# Altium project STM32WL_Sens_ADC_Bat.PrjPcb
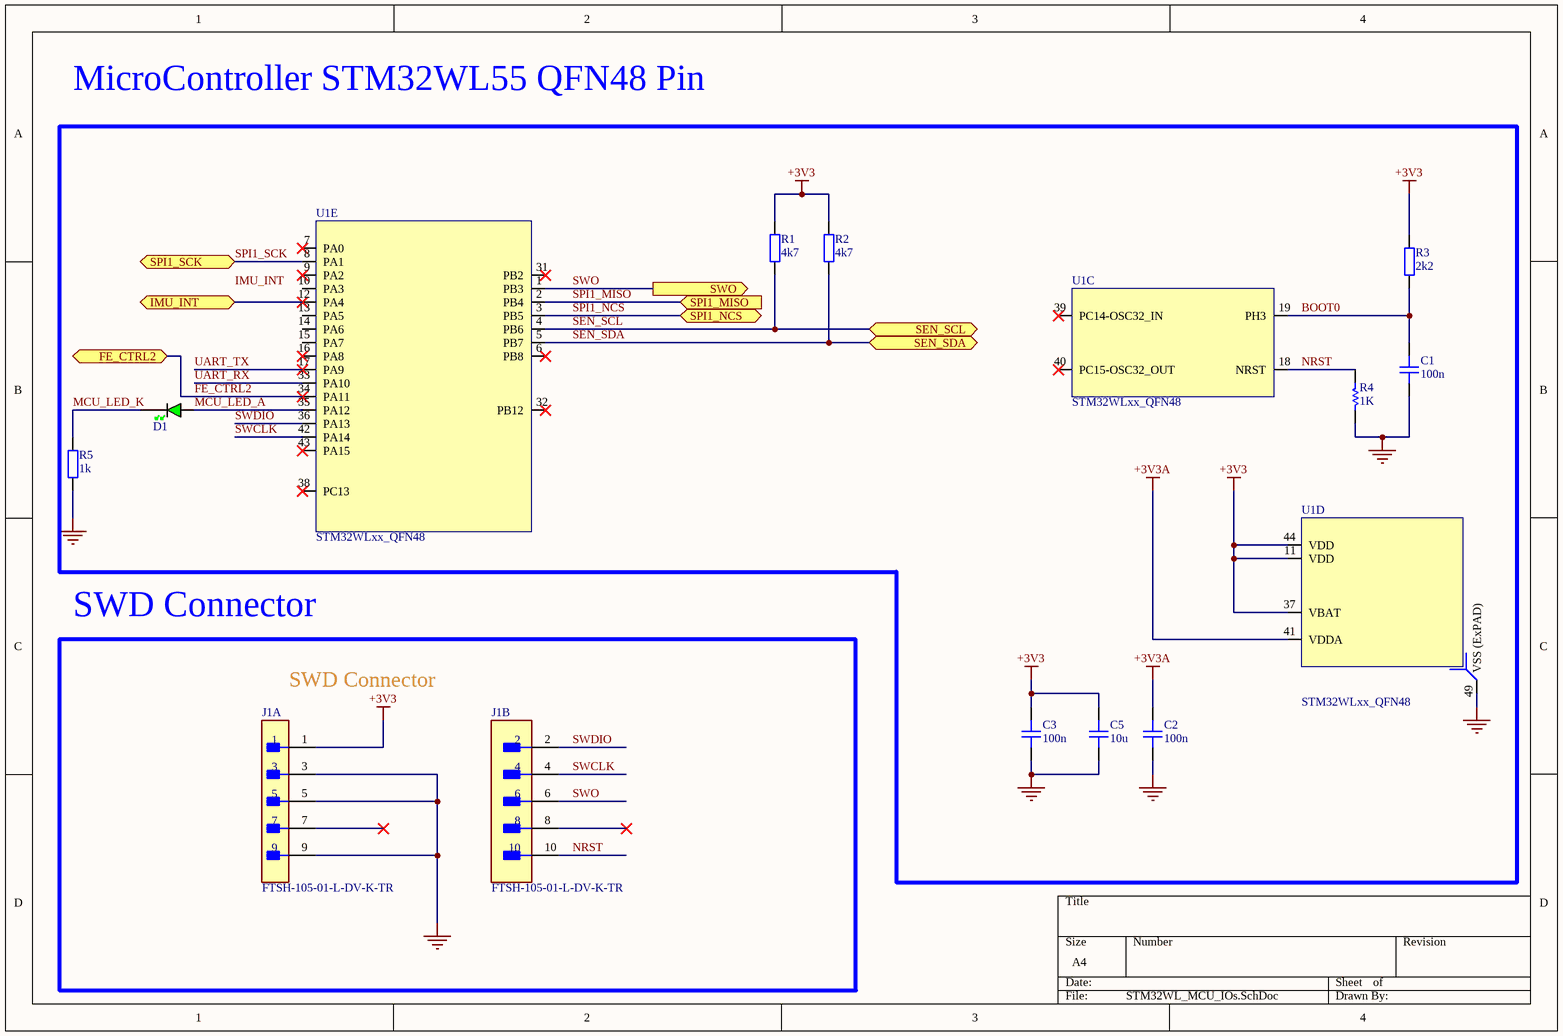
[diagram p0: STM32WL_MCU_IOs.SchDoc]
5 sheets, 114 parts. Net scope: flat (ports and power ports of the same name join across sheets).
Board file: STM32WL_RevA.PcbDoc
Sheets:
  STM32WL_MCU_IOs.SchDoc
  STM32WL_RF.SchDoc
  stm32wl_Power.SchDoc
  STM32WL_Sensors.SchDoc
  STM32WL_ADC.SchDoc

## Sheet STM32WL_MCU_IOs.SchDoc
size A4; SheetNumber: 1; SheetTotal: 5

### Parts
C1  100n  [CAP_0603]
C2  100n  [CAP_0603]
C3  100n  [CAP_0603]
C5  10u  [CAP_0603]
D1  GREEN  [LED_0402_GREEN]  (value not drawn)
J1  FTSH-105-01-L-DV-K-TR  [FP-FTSH-105-01-L-DV-K-TR-MFG]  (parts A,B of 2)
R1  4k7  [RES_0603]
R2  4k7  [RES_0603]
R3  2k2  [RES_0402]
R4  value 1K  [RES_0603]
R5  1k  [RES_0402]
U1  STM32WLxx_QFN48  [STM32WLxx_QFN48]  (parts C,D,E of 5)

### Blocks framed on the sheet
SWD Connector: J1

### Ports
FE_CTRL2 (bidir, see STM32WL_RF[3A]), IMU_INT (bidir, see STM32WL_Sensors[2B]), SEN_SCL (bidir, see STM32WL_Sensors[1B]), SEN_SDA (bidir, see STM32WL_Sensors[1B]), SPI1_MISO (in, see STM32WL_ADC[3C]), SPI1_NCS (bidir, see STM32WL_ADC[2D]), SPI1_SCK (bidir, see STM32WL_ADC[2D]), SWO (out)

### Nets
+3V3: C3.2 C5.2 J1.1 R1.2 R2.2 R3.2 U1.11(VDD) U1.37(VBAT) U1.44(VDD)
+3V3A: C2.2 U1.41(VDDA)
GND: C1.1 C2.1 C3.1 C5.1 J1.3 J1.5 J1.9 R4.1 R5.1 U1.49(VSS_(ExPAD))
BOOT0: C1.2 R3.1 U1.19(PH3)
FE_CTRL2: U1.34(PA11) ; port FE_CTRL2
MCU_LED_A: D1.A U1.35(PA12)
MCU_LED_K: D1.K R5.2
NRST: J1.10 R4.2 U1.18(NRST)
SEN_SCL: R1.1 U1.4(PB6) ; port SEN_SCL
SEN_SDA: R2.1 U1.5(PB7) ; port SEN_SDA
SPI1_MISO: U1.2(PB4) ; port SPI1_MISO
SPI1_NCS: U1.3(PB5) ; port SPI1_NCS
SPI1_SCK: U1.8(PA1) ; port SPI1_SCK
SWCLK: J1.4 U1.42(PA14)
SWDIO: J1.2 U1.36(PA13)
SWO: J1.6 U1.1(PB3) ; port SWO
UART_RX: U1.33(PA10)
UART_TX: U1.17(PA9)
NetU1_12: U1.12(PA4) ; port IMU_INT

Not connected (* = marked no-connect by the designer): J1 7* 8*; U1 6(PB8)* 7(PA0)* 9(PA2)* 10(PA3) 13(PA5) 14(PA6) 15(PA7) 16(PA8)* 31(PB2)* 32(PB12)* 38(PC13)* 39(PC14-OSC32_IN)* 40(PC15-OSC32_OUT)* 43(PA15)*

### Notes on the sheet
- MicroController STM32WL55 QFN48 Pin
- SWD Connector
- Labels drawn without touching a wire or pin: IMU_INT

### Library data of the parts
C1 = CAP_0402_16V: Capacitor SMD 0402 16V; Parameter 1: *; Parameter 2: *
C2 C3 = CAP_0201_16V: Capacitor SMD 0201 16V
C5 = CAP_0603_16V: Capacitor SMD 0603 16V
D1 = LED_0402_GREEN: LED 0402 GREEN SMD
J1 = CMP-2000-06293-2: CONN HEADER SMD 10POS 1.27MM; Max Current Rating: 1.75A; Number of Contacts: 10; Gender: Male; Row Spacing: 0.05inch; Connector Type: Male Pin; Housing Color: Black; Min Operating Temperature: -55°C; Depth: 3.43mm; Color: Black; Contact Plating: Gold; REACH SVHC: No SVHC; Packaging: Tape and Reel; Current Rating: 1.75A; Radiation Hardening: No; Package Quantity: 550; Number of Positions: 10; Max Operating Temperature: 125°C; Orientation: Straight; Termination: Solder; Contact Mating Length: 0.12inch; Number of Rows: 2; Lead Free: Lead Free; Contact Material: Bronze; Mount: Surface Mount; Housing Material: Polymer; Pitch: 1.27mm; Length: 6.35mm
R1 R2 = RES_0603: Resistor SMD 0603
R3 R5 = RES_0402: Resistor SMD 0402
R4 = MCD-00061: Resistor,1K,0402,1%,1/16W; Manufacturer_Part_Number: RC0402FR-071KL; Manufacturer: YAGEO; Provided_By: SUBCO; ECCN_US: EAR99; ECCN_EU: NEC; Internal_Part_Number: MCD-00061; Status: Released; Part_Type: Resistor; Package: R0402; ComponentLink1Description: Datasheet; ComponentLink1URL: http://tunmcdsvn.tun.st.com/Component_Datasheet_Library/Trunk/Resistors/Yageo_Resistor_RC0402-series
U1 = STM32WLxx_QFN48: HQDC : Verified April, 25 2019; Manufacturer: STMicroelectronics; Manufacturer_Part_Number: STM32WLE5CC

## Sheet STM32WL_RF.SchDoc
size A4; SheetNumber: 2; SheetTotal: 5
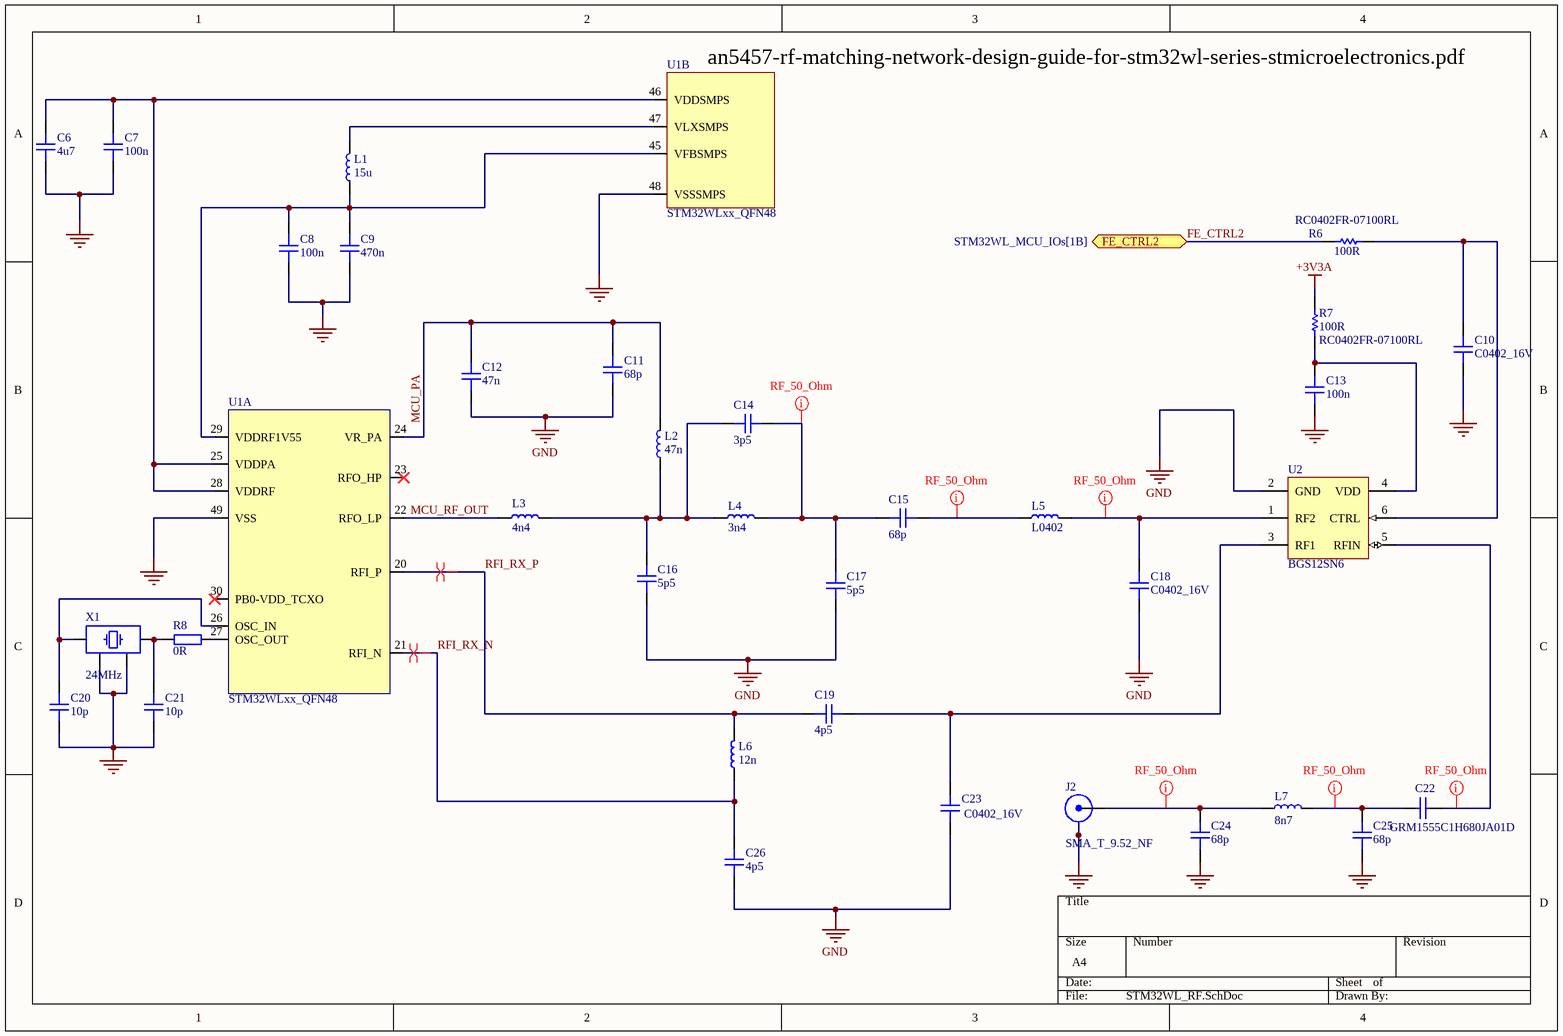
[diagram p1: STM32WL_RF.SchDoc]

### Parts
C6  4u7  [CAP_0603]
C7  100n  [CAP_0603]
C8  100n  [CAP_0603]
C9  470n  [CAP_0603]
C10  C0402_16V  [CAP_0402]
C11  68p  [CAP_0402]
C12  47n  [CAP_0402]
C13  100n  [CAP_0402]
C14  3p5  [CAP_0402]
C15  68p  [CAP_0402]
C16  5p5  [CAP_0402]
C17  5p5  [CAP_0402]
C18  C0402_16V  [CAP_0402]
C19  4p5  [CAP_0402]
C20  10p  [CAP_0402]
C21  10p  [CAP_0402]
C22  GRM1555C1H680JA01D  [CAPC1005X55X25LL05T10]
C23  C0402_16V  [CAP_0402]
C24  68p  [CAP_0402]
C25  68p  [CAP_0402]
C26  4p5  [CAP_0402]
J2  SMA_T_9.52_NF  [CO_SAMTEC_SMA-J-P-ST-EMI]
L1  15u  [IND_0402]
L2  47n  [IND_0402]
L3  4n4  [IND_0402]
L4  3n4  [IND_0402]
L5  L0402  [IND_0402]
L6  12n  [IND_0402]
L7  8n7  [IND_0402]
R6  value 100R  Manufacturer_Part_Number: RC0402FR-07100RL  [R0402]
R7  value 100R  Manufacturer_Part_Number: RC0402FR-07100RL  [R0402]
R8  0R  [RES_0402]
U1  STM32WLxx_QFN48  [STM32WLxx_QFN48]  (parts A,B of 5)
U2  BGS12SN6  [INF-TSNP-6-2_V]
X1  24MHz  [XTAL_3225]

### Ports
FE_CTRL2 (bidir, see STM32WL_MCU_IOs[1B])

### Nets
+3V3A: R7.2
GND: C6.1 C7.1 C8.1 C9.1 C10.1 C11.1 C12.1 C13.1 C16.1 C17.1 C18.1 C20.1 C21.1 C23.1 C24.1 C25.1 C26.1 J2.2(Y) U1.48(VSSSMPS) U1.49(VSS) U2.2(GND) X1.2 X1.4
FE_CTRL2: R6.1 ; port FE_CTRL2
MCU_PA: C11.2 C12.2 L2.2 U1.24(VR_PA)
MCU_RF_OUT: L3.1 U1.22(RFO_LP)
RFI_RX_N: C26.2 L6.1 U1.21(RFI_N)
RFI_RX_P: C19.1 L6.2 U1.20(RFI_P)
NetC6_2: C6.2 C7.2 U1.25(VDDPA) U1.28(VDDRF) U1.46(VDDSMPS)
NetC8_2: C8.2 C9.2 L1.1 U1.29(VDDRF1V55) U1.45(VFBSMPS)
NetC10_2: C10.2 R6.2 U2.6(CTRL)
NetC13_2: C13.2 R7.1 U2.4(VDD)
NetC14_1: C14.1 C16.2 L2.1 L3.2 L4.1
NetC14_2: C14.2 C15.1 C17.2 L4.2
NetC15_2: C15.2 L5.1
NetC18_2: C18.2 L5.2 U2.1(RF2)
NetC19_2: C19.2 C23.2 U2.3(RF1)
NetC20_2: C20.2 U1.26(OSC_IN) X1.1
NetC21_2: C21.2 R8.1 X1.3
NetC22_1: C22.1 C25.2 L7.2
NetC22_2: C22.2 U2.5(RFIN)
NetC24_2: C24.2 J2.1(X) L7.1
NetL1_2: L1.2 U1.47(VLXSMPS)
NetR8_2: R8.2 U1.27(OSC_OUT)

Not connected (* = marked no-connect by the designer): U1 23(RFO_HP)* 30(PB0-VDD_TCXO)*

### Layout directives
net class RF_50_Ohm: NetC14_2, NetC15_2, NetC18_2, NetC22_1, NetC22_2, NetC24_2
differential pair: RFI_RX_N, RFI_RX_P

### Notes on the sheet
- (near U1) an5457-rf-matching-network-design-guide-for-stm32wl-series-stmicroelectronics.pdf

### Library data of the parts
C6-C9 = CAP_0201_16V: Capacitor SMD 0201 16V
C10-C21 C23-C25 = CAP_0402_16V: Capacitor SMD 0402 16V
C22 = CMP-2008-04406-1: Manufacturer: Murata; Part Number: GRM1555C1H680JA01D
C26 = CAP_0402_16V
J2 = SMA_T_9.52_NF: SMA End Launch Jack 1.0 mm Board, 50 ohm; Manufacturer: COAX CONNECTORS LTD; Manufacturer_Part_Number: 30-462-D3-1.1mm
L1 L2 L4-L7 = IND_0402: Inductor SMD 0402
L3 = IND_0402: Inductor SMD 0402 LQW15AN4N4G80D
R6 R7 = MCD-00119: Resistor,100R,0402,1%,1/16W; Manufacturer: YAGEO; Provided_By: SUBCO; ECCN_US: EAR99; ECCN_EU: NEC; Internal_Part_Number: MCD-00119; Status: Released; Part_Type: Resistor; Package: R0402; ComponentLink1Description: Datasheet; ComponentLink1URL: http://tunmcdsvn.tun.st.com/Component_Datasheet_Library/Trunk/Resistors/Yageo_Resistor_RC0402-series
R8 = RES_0402: Resistor SMD 0402
U1 = STM32WLxx_QFN48: as U1 on sheet STM32WL_MCU_IOs
U2 = CMP-1088-00016-1: Wideband RF SPDT Switch, 0.1 to 6 GHz, TSNP-6, Reel, Green; Manufacturer: Infineon; Green: TRUE; Supply Voltage Range: 1.8 - 3.5; Packing: Tape and Reel; Isolation @1GHz: 40 dB; Insertion Loss @1GHz: 0.25 dB; Pmax: 30 dBm; ComponentLink2URL: http://www.infineon.com/dgdl/BGS12SN6_2014-05-23.pdf?folderId=db3a30431f848401011fcbf2ab4c04c4&fileId=db3a30433f1b26e8013f2db58bc03856; PackageReference: TSNP-6-2; PartNumber: BGS12SN6; DatasheetVersion: Rev. 1.2; ComponentLink3URL: http://www.infineon.com/dgdl/TSNP-6-2-Package_Overview.pdf?folderId=db3a304327b89750012805e1379a6124&fileId=db3a30433c6612b1013c6bcb02293ba1; ComponentLink2Description: Datasheet; PackageDescription: 6-Pin Thin Small Non Leaded Package, 1.1 x 0.7 mm Body, 0.4 mm Pitch; ComponentLink1URL: http://www.infineon.com/; Frequency ( f ) Range: 0.1 to 6 GHz; Switch Type: SPDT; Mounting Technology: Surface Mount; Halogen-free: TRUE; PackageVersion: Jan-13; ComponentLink3Description: Package Specification; ComponentLink1Description: Manufacturer URL
X1 = TSX-3225_24.0000MF15X-AC: Crystal SMD 24MHz 10PPM 7pF 3225; Manufacturer: Epson; Manufacturer Number: TSX-3225 24.0000MF15X-AC; ESR: 40R; Value: 24MHz; Type: XTAL; Load Capacitance: 7pF

## Sheet stm32wl_Power.SchDoc
size A4; SheetNumber: 3; SheetTotal: 5; SPICEModelCacheDIGUCLON: <root> / <DocumentId>DIGUCLON</DocumentId> / <CacheFrame Number="0"> / <Model Name="mcp6001" Kind="CKT"> / <Text>.SUBCKT MCP6001 1 2 3 4 5 / *               | | | | | / *               | | | | Output / *               | | | Negative Supply / *               | | Positive Supply / *               | Inverting Input / *               Non-inverting Input / * / ******************************************************************************** / * Software License Agreement                                                   * / *                                                                              * / * The software supplied herewith by Microchip Technology Incorporated (the     * / * "Company") is intended and supplied to you, the Company's customer, for use  * / * soley and exclusively on Microchip products.                                 * / *                                                                              * / * The software is owned by the Company and/or its supplier, and is protected   * / * under applicable copyright laws. All rights are reserved. Any use in         * / * violation of the foregoing restrictions may subject the user to criminal     * / * sanctions under applicable laws, as well as to civil liability for the       * / * breach of the terms and conditions of this license.                          * / *                                                                              * / * THIS SOFTWARE IS PROVIDED IN AN "AS IS" CONDITION. NO WARRANTIES, WHETHER    * / * EXPRESS, IMPLIED OR STATUTORY, INCLUDING, BUT NOT LIMITED TO, IMPLIED        * / * WARRANTIES OF MERCHANTABILITY AND FITNESS FOR A PARTICULAR PURPOSE APPLY TO  * / * THIS SOFTWARE. THE COMPANY SHALL NOT, IN ANY CIRCUMSTANCES, BE LIABLE FOR    * / * SPECIAL, INCIDENTAL OR CONSEQUENTIAL DAMAGES, FOR ANY REASON WHATSOEVER.     * / ******************************************************************************** / * / * Macromodel for the MCP6001/2/4 op amp family: / *   MCP6001, MCP6001R, MCP6001U, MCP6002, MCP6004 / * / * Revision History: / *   REV A: 21-Jun-02, Created model / *   REV B: 16-Jul-02, Improved output stage / *   REV C: 03-Jan-03, Added MCP6001 / *   REV D: 19-Aug-06, Added over temperature, improved output stage, / *                     fixed overdrive recovery time / *   REV E: 27-Jul-07, Updated output impedance for better model stability w/cap load / *   REV F: 09-Jul-12, Added MCP6001R, MCP6001U / * / * Recommendations: / *   Use PSPICE (other simulators may require translation) / *   For a quick, effective design, use a combination of: data sheet / *     specs, bench testing, and simulations with this macromodel / *   For high impedance circuits, set GMIN=100F in .OPTIONS / * / * Supported: / *   Typical performance for temperature range (-40 to 125) degrees Celsius / *   DC, AC, Transient, and Noise analyses. / *   Most specs, including: offsets, DC PSRR, DC CMRR, input impedance, / *     open loop gain, voltage ranges, supply current, ... , etc. / *   Temperature effects for Ibias, Iquiescent, Iout short circuit / *   current, Vsat on both rails, Slew Rate vs. Temp and P.S. / * / * Not Supported: / *   Some Variation in specs vs. Power Supply Voltage / *   Monte Carlo (Vos, Ib), Process variation / *   Distortion (detailed non-linear behavior) / *   Behavior outside normal operating region / * / * Input Stage / V10  3 10 -500M / R10 10 11 6.90K / R11 10 12 6.90K / C11 11 12 0.2p / C12 1  0 6.00P / E12 71 14 POLY(4) 20 0 21 0 26 0 27 0   1.00M 20.1 20.1 1 1 / G12 1 0 62 0 1m / M12 11 14 15 15 NMI L=2.00U W=42.0U / M14 12  2 15 15 NMI L=2.00U W=42.0U / G14 2 0 62 0 1m / C14  2  0 6.00P / I15 15  4 50.0U / V16 16  4 -300M / GD16 16 1 TABLE {V(16,1)} ((-100,-1p)(0,0)(1m,1n)(2m,1m)(3m,1)) / V13  3 13 -300M / GD13 2 13 TABLE {V(2,13)} ((-100,-1p)(0,0)(1m,1n)(2m,1m)(3m,1)) / R70 1 0 20.6T / R71 2 0 20.6T / R72 1 2 20T / I80 1 2 0.5p / * / * Noise, PSRR, and CMRR / I20 21 20 423U / D20 20  0 DN1 / D21  0 21 DN1 / G26  0 26 POLY(1) 3 4   110U -49U / R26 26  0 1 / G27  0 27 POLY(2) 1 0 2 0   -440U 39.7U 39.7U / R27 27  0 1 / * / * Open Loop Gain, Slew Rate / G30  0 30 POLY(1) 12 11   0 1 / R30 30  0 1K / G31  0 31 POLY(1) 3 4 86 5.25 / R31 31  0 1 TC=2.8m / GD31 30 31 TABLE {V(30,31)} ((-11,-1)(-10,-10n)(0,0)(1m,1000)) / G32 32  0 POLY(1) 3 4 113.7 3.5 / R32 32  0 1 TC=2.65m / GD32 30 32 TABLE {V(30,32)} ((-1m,-1000)(0,0)(10,10n)(11,1)) / G33 0 33 30 0 1m / R33 33 0 1k / G34  0 34 33 0 425M / R34  34 0 1K / C34  34 0 74U / G37  0 37 34 0 1m / R37  37 0 1K / C37  37 0 41.6P / G38  0 38 37 0 1m / R38  39 0 1K / L38  38 39 100U / E38  35 0 38 0 1 / G35 33 0 TABLE {V(35,3)} ((-1,-1n)(0,0)(16,1n))(16.1,1)) / G36 33 0 TABLE {V(35,4)} ((-16.1,-1)((-16,-1n)(0,0)(1,1n)) / * / * Output Stage / R80 50 0 100MEG / G50 0 50 57 96 2 / R58 57  96 0.50 / R57 57  0 750 / C58  5  0 2.00P / G57  0 57 POLY(3) 3 0 4 0 35 0   0 0.67M 0.67M 1.5M / GD55 55 57 TABLE {V(55,57)} ((-2m,-1)(-1m,-1m)(0,0)(10,1n)) / GD56 57 56 TABLE {V(57,56)} ((-2m,-1)(-1m,-1m)(0,0)(10,1n)) / E55 55  0 POLY(2) 3 0 51 0 -0.7m 1 -40.0M / E56 56  0 POLY(2) 4 0 52 0 1.2m 1 -37.0M / R51 51 0 1k / R52 52 0 1k / GD51 50 51 TABLE {V(50,51)} ((-10,-1n)(0,0)(1m,1m)(2m,1)) / GD52 50 52 TABLE {V(50,52)} ((-2m,-1)(-1m,-1m)(0,0)(10,1n)) / G53  3  0 POLY(1) 51 0  -49U 1M / G54  0  4 POLY(1) 52 0  -49U -1M / * / * Current Limit / G99 96 5 99 0 1 / R98 0 98 1 TC=-2.8M,2.63U / G97 0 98 TABLE { V(96,5) } ((-11.0,-10.0M)(-1.00M,-9.9M)(0,0)(1.00M,9.9M)(11.0,10.0M)) / E97 99 0 VALUE { V(98)*((V(3)-V(4))*359M + 310M)} / D98 4 5 DESD / D99 5 3 DESD / * / * Temperature / Voltage Sensitive IQuiscent / R61 0 61 100 TC 3.11M 4.51U / G61 3 4 61 0 1 / G60 0 61 TABLE {V(3, 4)} / + ((0,0)(900M,0.0106U)(1.00,0.20U)(1.3,0.63U) / + (1.5,0.66U)(1.6,1.06U)(5.5,1.10U)) / * / * Temp Sensitive offset voltage / I73 0 70 DC 1uA / R74 0 70 1 TC=2 / E75 1 71 70 0 1 / * / * Temp Sensistive IBias / I62 0 62 DC 1uA / R62 0 62 REXP 58.2u / * Voltage on R62 used for G12, G14 in input stage / * / * Models / .MODEL NMI NMOS / .MODEL DESD  D   N=1 IS=1.00E-15 / .MODEL DL  D   N=1 IS=1F / .MODEL DN1 D   IS=1P KF=146E-18 AF=1 / .MODEL REXP RES TCE=10.1 / .ENDS MCP6001</Text> / </Model> / </CacheFrame> / </root>
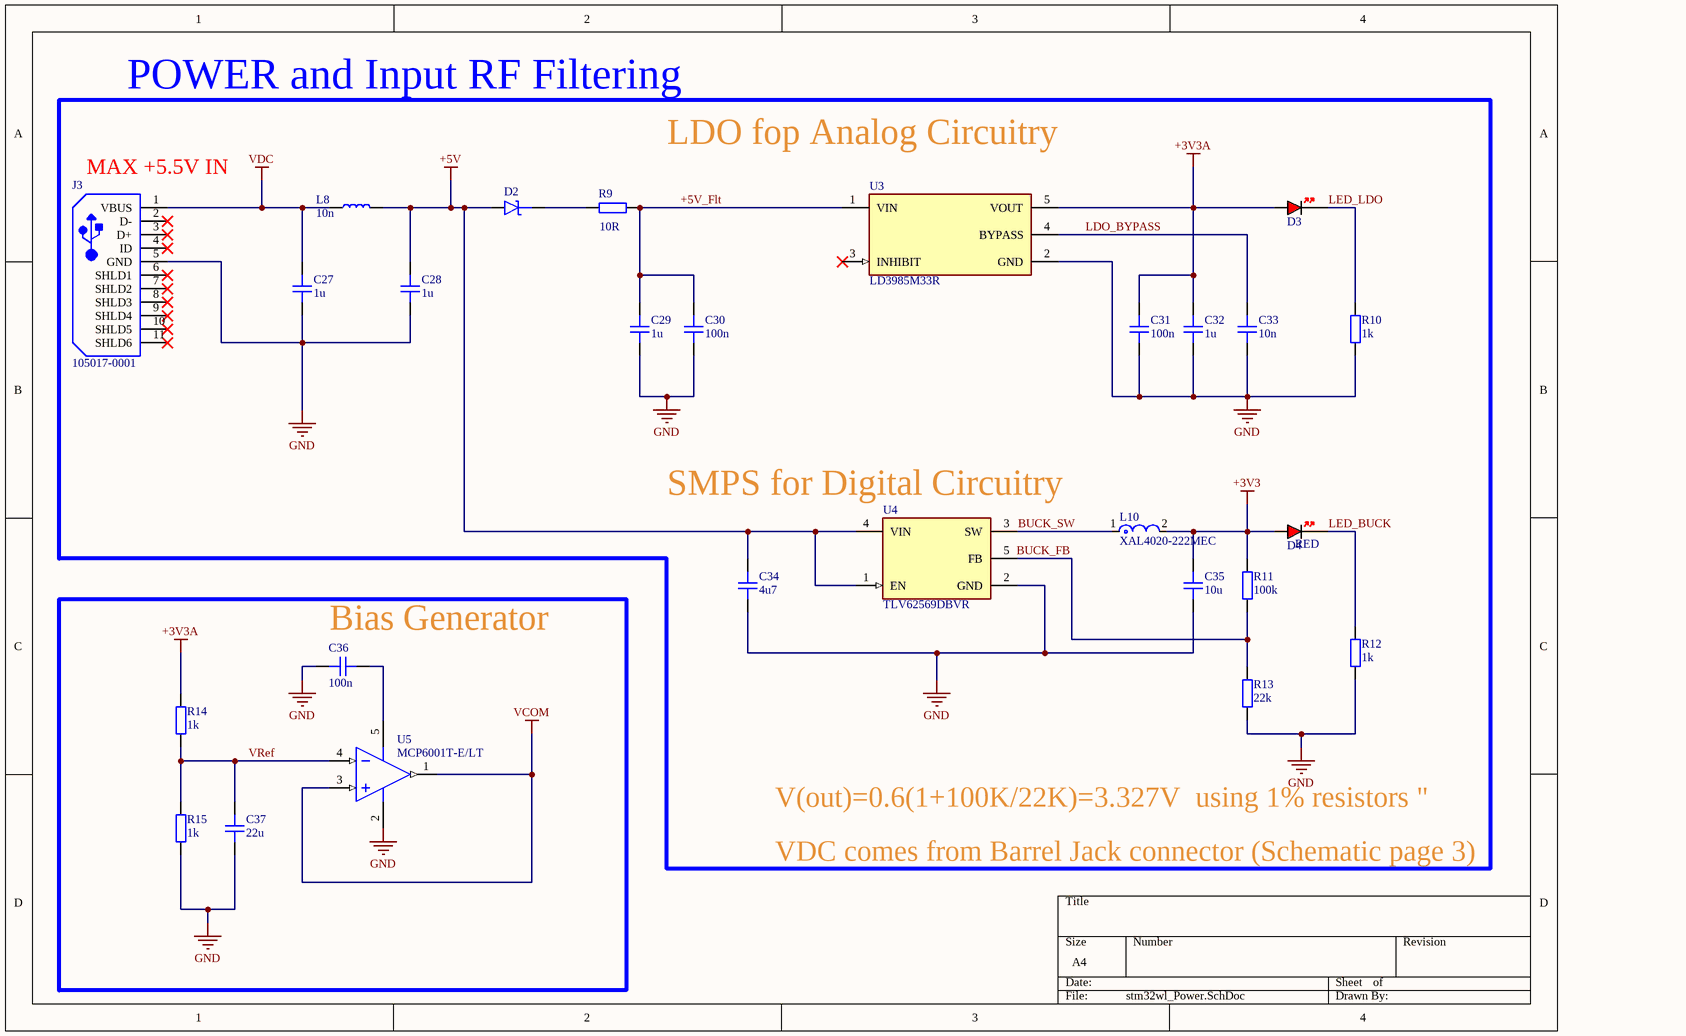
[diagram p2: stm32wl_Power.SchDoc]

### Parts
C27  1u  [CAP_0603]
C28  1u  [CAP_0603]
C29  1u  [CAP_0603]
C30  100n  [CAP_0603]
C31  100n  [CAP_0603]
C32  1u  [CAP_0603]
C33  10n  [CAP_0603]
C34  4u7  [CAP_0603]
C35  10u  [CAP_0603]
C36  100n  [CAP_0402]
C37  22u  [CAP_0603]
D2  D_SCHOTTKY_SOD_323  [SOD-323]  (value not drawn)
D3  RED  [LED_0402_RED]  (value not drawn)
D4  RED  [LED_0402_RED]
J3  105017-0001  [USB-MICRO-B_V]
L8  10n  [IND_0603]
L10  XAL4020-222MEC  [FP-XAL4020-MFG]
R9  10R  [RES_0603]
R10  1k  [RES_0402]
R11  100k  [RES_0402]
R12  1k  [RES_0402]
R13  22k  [RES_0402]
R14  1k  [RES_0402]
R15  1k  [RES_0402]
U3  LD3985M33R  [FP-SOT23-5L-7049676-IPC_C]
U4  TLV62569DBVR  [FP-DBV0005A-MFG]
U5  MCP6001T-E/LT  [SC70-LT5_L]

### Blocks framed on the sheet
POWER and Input RF Filtering: C27-C35 D2-D4 J3 L8 L10 R9-R13 U3 U4
Bias Generator: C36 C37 R14 R15 U5

### Nets
+3V3: C35.2 D4.A L10.2 R11.2
+3V3A: C31.2 C32.2 D3.A R14.2 U3.5(VOUT)
+5V: C28.2 C34.2 D2.A L8.2 U4.1(EN) U4.4(VIN)
GND: C27.1 C28.1 C29.1 C30.1 C31.1 C32.1 C33.1 C34.1 C35.1 C36.2 C37.1 J3.5(GND) R10.1 R12.1 R13.1 R15.1 U3.2(GND) U4.2(GND) U5.2(VSS)
VCOM: U5.1(VOUT) U5.3(VIN+)
VDC: C27.2 J3.1(VBUS) L8.1
+5V_Flt: C29.2 C30.2 R9.2 U3.1(VIN)
BUCK_FB: R11.1 R13.2 U4.5(FB)
BUCK_SW: L10.1 U4.3(SW)
LDO_BYPASS: C33.2 U3.4(BYPASS)
LED_BUCK: D4.K R12.2
LED_LDO: D3.K R10.2
VRef: C37.2 R14.1 R15.2 U5.4(VIN-)
NetC36_1: C36.1 U5.5(VDD)
NetD2_K: D2.K R9.1

Not connected (* = marked no-connect by the designer): J3 2(D-)* 3(D+)* 4(ID)* 6(SHLD1)* 7(SHLD2)* 8(SHLD3)* 9(SHLD4)* 10(SHLD5)* 11(SHLD6)*; U3 3(INHIBIT)*

### Notes on the sheet
- (near J3) MAX +5.5V IN
- LDO fop Analog Circuitry
- SMPS for Digital Circuitry
- V(out)=0.6(1+100K/22K)=3.327V  using 1% resistors "
- VDC comes from Barrel Jack connector (Schematic page 3)

### Library data of the parts
C27-C35 C37 = CAP_0603_16V: Capacitor SMD 0603 16V
C36 = CAP_0402_16V: Capacitor SMD 0402 16V
D2 = D_SCHOTTKY_SOD_323: Diode Schottky SMD SOD-323
D3 D4 = LED_0402_RED: LED 0402 RED SMD
J3 = CMP-2000-05827-1: Micro-USB B Receptacle, Right Angle, Bottom Mount, Surface Mount, with Solder Tabs, -30 to 85 degC, 5-Pin USB, RoHS, Tape and Reel; Manufacturer: Molex; Featured Product: Micro-USBConnectorsUSBConnectors; Other Names: WM1399DKR; Package Version: Rev. F, 12/2012; Number of Contacts: 5; Connector Type: USB-microB; Catalog Drawings: 1050170001; 3D Model: 105017-0001.stp; Mating Products: WM17145-ND-CABLEMICROUSBBTOSTDA1.0MWM17147-ND-CABLEMICROUSBBTOSTDA2.0MWM17146-ND-CABLEMICROUSBBTOSTDA1.5M; PCN Assembly/Origin: ResinSupplier21/Oct/2015; Voltage - Max: 30V; Online Catalog: Molex-MicroUSB; Manufacturer URL: http://www.molex.com/; Package Description: 5-Leads USB, Micro B, Body 7.5 x 5 mm, Pitch 0.65 mm; Datasheet URL: http://www.molex.com/elqNow/elqRedir.htm?ref=http://www.molex.com/webdocs/datasheets/pdf/en-us/1050170001_IO_CONNECTORS.pdf; Ingress Protection: -; Datasheet Version: 03/2016; Mounting Type: BoardCutout,SurfaceMount,RightAngle; Circuits: 5; Standard Package: 1; Package Reference: MICRO-B; Package URL: http://www.molex.com/pdm_docs/sd/1050170001_sd.pdf; Category: Connectors,Interconnects; Series: -; RoHS Information: 1050170001CertofCompliance; Features: Shielded,SolderRetention; Family: USB,DVI,HDMIConnectors; Specifications: -; Gender: Receptacle; Packaging: Digi-Reel®; Mounting Technology: SurfaceMount
L8 = IND_0603: Inductor SMD 0603
L10 = CMP-11268-000134-1: Fixed Inductors 2.2uH Shld 20% 5.5A 38.7mOhms AECQ2; Saturation Current: 5.6A; Core Material: Composite; DC Resistance (DCR): 38.7mR; Self Resonant Frequency: 52MHz; Test Frequency: 100kHz; Shielding: Shielded; Length: 4.3mm; Tolerance: 20%; Packaging: Tape and Reel; Height: 2.1mm; Mount: Surface Mount; Termination: SMD/SMT; Lead Free: Contains Lead; Package Quantity: 1000; Inductance: 2.2uH; Series: XAL4020; Min Operating Temperature: -40°C; Max DC Current: 5.5A; Max Operating Temperature: 125°C; Case/Package: SMD/SMT; Inductance Tolerance: 20%; RMS Current (Irms): 5.5A; Width: 4.3mm; RoHS Compliant: Yes
R9 = RES_0603: Resistor SMD 0603
R10-R15 = RES_0402: Resistor SMD 0402
U3 = CMP-0244-00328-3: NexarPartId: 526998; Min Output Voltage: 3.3V; Min Input Voltage: 2.5V; Max Junction Temperature (Tj): 125°C; Min Current Limit: 300mA; Input Bias Current: 85µA; Max Supply Voltage: 6V; Quiescent Current: 150µA; Max Output Current: 150mA; Number of Channels: 1; Output Type: Fixed; Output Voltage Accuracy: 2%; Polarity: Positive; Dropout Voltage: 60mV; Width: 1.75mm; Height: 1.3mm; Lifecycle Status: Production; Case/Package: SOT-23; RoHS: Compliant; Output Current: 150mA; Radiation Hardening: No; Number of Regulators: 1; Max Operating Temperature: 125°C; Output Voltage: 3.3V; Min Supply Voltage: 2.5V; Min Operating Temperature: -40°C; Accuracy: 2%; Number of Outputs: 1; Number of Pins: 5; Packaging: Cut Tape (CT); Lead Free: Lead Free; Schedule B: 8542390000, 8542390000|8542390000, 8542390000|8542390000|8542390000, 8542390000|8542390000|8542390000|8542390000; Mount: Surface Mount; Max Input Voltage: 6V; Length: 3mm
U4 = CMP-04918-000387-1: IC REG BUCK ADJ 2A SOT23-5; Output Configuration: Positive; Min Output Voltage: 600mV; Max Output Voltage: 5.5V; Switching Frequency: 1.5MHz; Output Type: Adjustable; Synchronous Rectifier: Yes; Min Input Voltage: 2.5V; Output Current: 2A; Mount: Surface Mount; Min Operating Temperature: -40°C; Max Operating Temperature: 125°C; RoHS Compliant: Yes; Max Input Voltage: 5.5V; Case/Package: SOT-23-5; Packaging: Cut Tape
U5 = CMP-0187-00463-3: None; Unity Gain Bandwidth Product: 1MHz; Output Current: 23mA; Input Offset Voltage-Max: 4.5mV; Supply Current: 100uA; Power Supply Rejection Ratio (PSRR): 86dB; Amplifier Type: GENERAL PURPOSE; Slew Rate: 0.6V/µs; Number of Amplifiers: 1; Min Supply Voltage: 1.8V; Voltage Gain: 112dB; Common Mode Rejection Ratio: 60dB; Input Bias Current: 1pA; Max Supply Voltage: 6V; Operating Supply Voltage: 5.5V; Min Operating Temperature: -40°C; Width: 1.35mm; RoHS Compliant: Yes; Number of Pins: 5; Input Offset Voltage (Vos): 4.5mV; Packaging: Tape and Reel; Lead Free: Lead Free; Nominal Supply Current: 100uA; Technology: CMOS; Contact Plating: Tin; Height: 1mm; Mount: Surface Mount; Radiation Hardening: No; Gain Bandwidth Product: 1MHz; Number of Channels: 1; Bandwidth: 1MHz; Case/Package: SC; REACH SVHC: No SVHC; Number of Circuits: 1; Number of Elements: 1; Package Quantity: 3000; Length: 2.25mm; Slew Rate-Nom: 0.6V/µs; Max Operating Temperature: 125°C

## Sheet STM32WL_Sensors.SchDoc
size A4; SheetNumber: 4; SheetTotal: 5
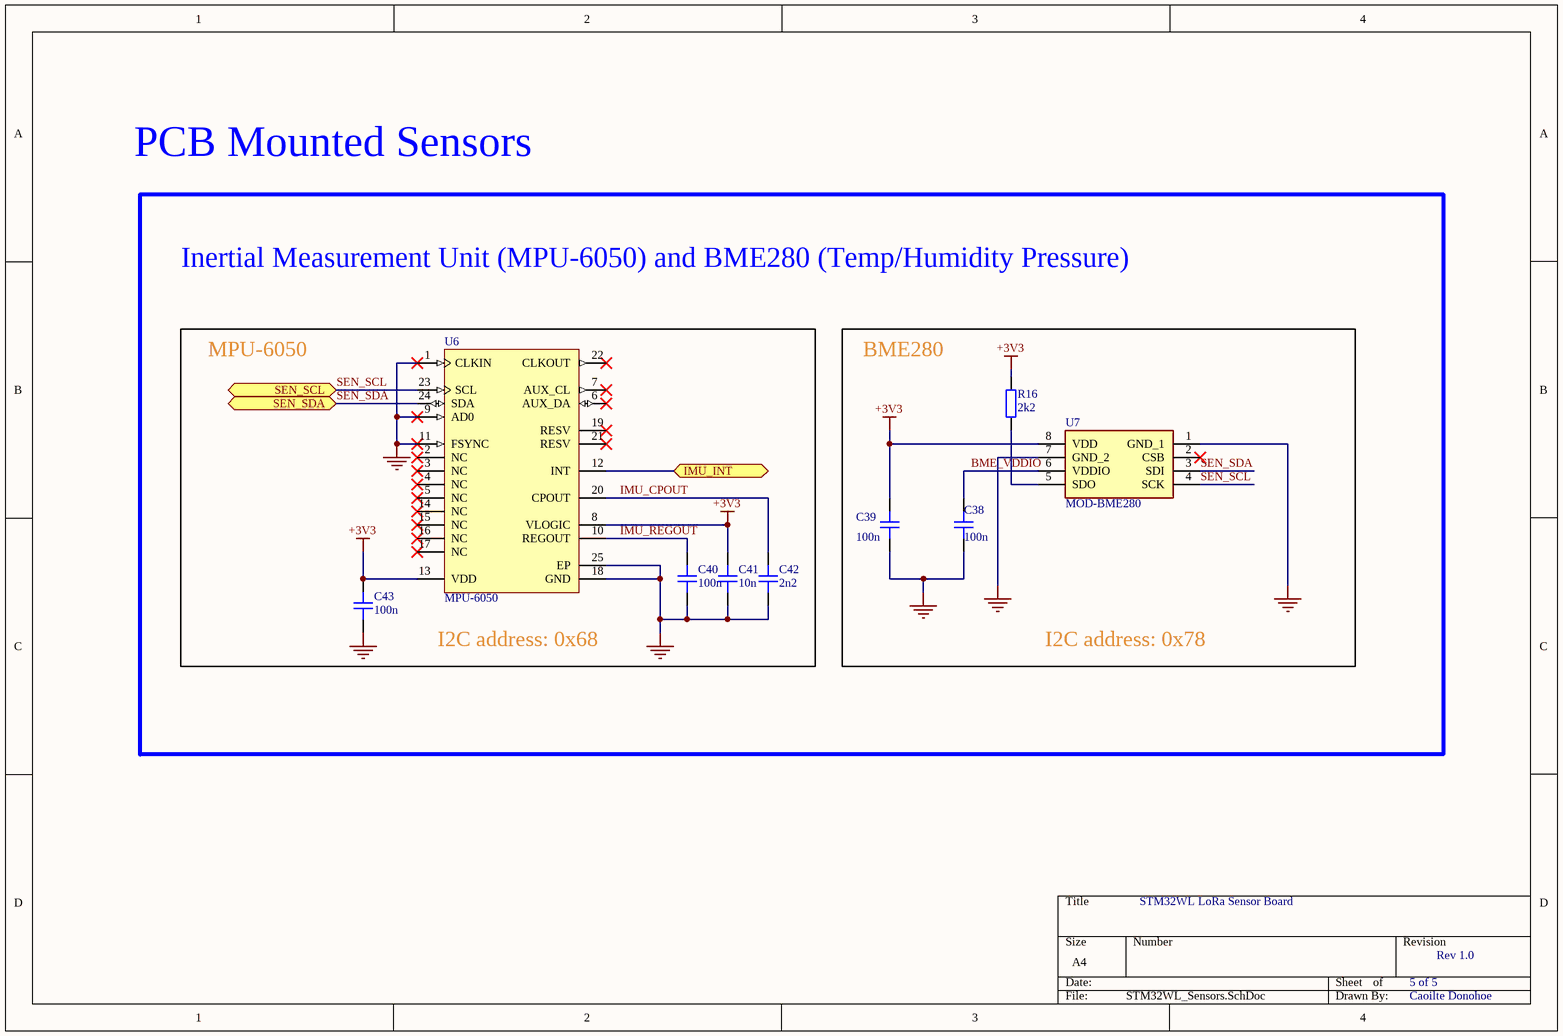
[diagram p3: STM32WL_Sensors.SchDoc]

### Parts
C38  100n  [CAP_0402]
C39  100n  [CAP_0402]
C40  100n  [CAP_0402]
C41  10n  [CAP_0402]
C42  2n2  [CAP_0402]
C43  100n  [CAP_0402]
R16  2k2  [RES_0402]
U6  MPU-6050  [IS-QFN-24_V]
U7  MOD-BME280  [MODBME280]

### Ports
IMU_INT (bidir, see STM32WL_MCU_IOs[1B]), SEN_SCL (bidir, see STM32WL_MCU_IOs[3B]), SEN_SDA (bidir, see STM32WL_MCU_IOs[3B])

### Nets
+3V3: C39.2 C41.2 C43.2 R16.2 U6.8(VLOGIC) U6.13(VDD) U7.8(VDD)
GND: C38.1 C39.1 C40.1 C41.1 C42.1 C43.1 U6.1(CLKIN) U6.9(AD0) U6.11(FSYNC) U6.18(GND) U6.25(EP) U7.1(GND_1) U7.7(GND_2)
BME_VDDIO: C38.2 U7.6(VDDIO)
IMU_CPOUT: C42.2 U6.20(CPOUT)
IMU_REGOUT: C40.2 U6.10(REGOUT)
SEN_SCL: U6.23(SCL) U7.4(SCK) ; port SEN_SCL
SEN_SDA: U6.24(SDA) U7.3(SDI) ; port SEN_SDA
NetR16_1: R16.1 U7.5(SDO)
NetU1_12: U6.12(INT) ; port IMU_INT

Not connected (* = marked no-connect by the designer): U6 2(NC)* 3(NC)* 4(NC)* 5(NC)* 6(AUX_DA)* 7(AUX_CL)* 14(NC)* 15(NC)* 16(NC)* 17(NC)* 19(RESV)* 21(RESV)* 22(CLKOUT)*; U7 2(CSB)*

### Notes on the sheet
- PCB Mounted Sensors
- Inertial Measurement Unit (MPU-6050) and BME280 (Temp/Humidity Pressure)
- MPU-6050
- BME280
- I2C address: 0x68
- I2C address: 0x78
- STM32WL LoRa Sensor Board
- 5 of 5
- Rev 1.0
- Caoilte Donohoe
- Labels drawn without touching a wire or pin: BME_SDO

### Library data of the parts
C38-C43 = CAP_0402_16V: Capacitor SMD 0402 16V
R16 = RES_0402: Resistor SMD 0402
U6 = CMP-1753-00002-2: 3-Axis Gyroscope, Accelerometer and a Digital Motion Processor(TM) (DMP), 2.375 to 3.46 V, -40 to 85 degC, 24-Pin QFN, RoHS, Tape and Reel; Manufacturer: InvenSense; Featured Product: MPU-60506-Axis,IntegratedI²CSolution; Other Names: 1428-1007-2 / MPU6050; Sensor Type: MotionTracking; Online Catalog: MPU-6000™Series; Unit PriceUSD: Digital; Datasheet Version: Rev. 3.3, 05/2012; Category: Sensors,Transducers; Datasheet URL: http://datasheet.octopart.com/MPU-6050-InvenSense-datasheet-14421344.pdf; Family: Multifunction; Standard Package: 5,000; Manufacturer URL: http://www.invensense.com/; Output Type: Digital; Dynamic Catalog: MPU-6000™Series
U7 = MOD-BME280: Integrated Circuit; Manufacturer_Name: Olimex Ltd.; Datasheet Link: https://eu.mouser.com/datasheet/2/306/BME280-1620794.pdf; Height: 1mm; Manufacturer_Part_Number: MOD-BME280; Mouser Part Number: 909-MOD-BME280; Mouser Price/Stock: https://www.mouser.co.uk/ProductDetail/Olimex-Ltd/MOD-BME280?qs=%252B6g0mu59x7K82sEO3yPPgg%3D%3D

## Sheet STM32WL_ADC.SchDoc
size A4; SheetNumber: 5; SheetTotal: 5; SPICEModelCacheMWGQCNEB: <root> / <DocumentId>MWGQCNEB</DocumentId> / <CacheFrame Number="0"> / <Model Name="mcp6001" Kind="CKT"> / <Text>.SUBCKT MCP6001 1 2 3 4 5 / *               | | | | | / *               | | | | Output / *               | | | Negative Supply / *               | | Positive Supply / *               | Inverting Input / *               Non-inverting Input / * / ******************************************************************************** / * Software License Agreement                                                   * / *                                                                              * / * The software supplied herewith by Microchip Technology Incorporated (the     * / * "Company") is intended and supplied to you, the Company's customer, for use  * / * soley and exclusively on Microchip products.                                 * / *                                                                              * / * The software is owned by the Company and/or its supplier, and is protected   * / * under applicable copyright laws. All rights are reserved. Any use in         * / * violation of the foregoing restrictions may subject the user to criminal     * / * sanctions under applicable laws, as well as to civil liability for the       * / * breach of the terms and conditions of this license.                          * / *                                                                              * / * THIS SOFTWARE IS PROVIDED IN AN "AS IS" CONDITION. NO WARRANTIES, WHETHER    * / * EXPRESS, IMPLIED OR STATUTORY, INCLUDING, BUT NOT LIMITED TO, IMPLIED        * / * WARRANTIES OF MERCHANTABILITY AND FITNESS FOR A PARTICULAR PURPOSE APPLY TO  * / * THIS SOFTWARE. THE COMPANY SHALL NOT, IN ANY CIRCUMSTANCES, BE LIABLE FOR    * / * SPECIAL, INCIDENTAL OR CONSEQUENTIAL DAMAGES, FOR ANY REASON WHATSOEVER.     * / ******************************************************************************** / * / * Macromodel for the MCP6001/2/4 op amp family: / *   MCP6001, MCP6001R, MCP6001U, MCP6002, MCP6004 / * / * Revision History: / *   REV A: 21-Jun-02, Created model / *   REV B: 16-Jul-02, Improved output stage / *   REV C: 03-Jan-03, Added MCP6001 / *   REV D: 19-Aug-06, Added over temperature, improved output stage, / *                     fixed overdrive recovery time / *   REV E: 27-Jul-07, Updated output impedance for better model stability w/cap load / *   REV F: 09-Jul-12, Added MCP6001R, MCP6001U / * / * Recommendations: / *   Use PSPICE (other simulators may require translation) / *   For a quick, effective design, use a combination of: data sheet / *     specs, bench testing, and simulations with this macromodel / *   For high impedance circuits, set GMIN=100F in .OPTIONS / * / * Supported: / *   Typical performance for temperature range (-40 to 125) degrees Celsius / *   DC, AC, Transient, and Noise analyses. / *   Most specs, including: offsets, DC PSRR, DC CMRR, input impedance, / *     open loop gain, voltage ranges, supply current, ... , etc. / *   Temperature effects for Ibias, Iquiescent, Iout short circuit / *   current, Vsat on both rails, Slew Rate vs. Temp and P.S. / * / * Not Supported: / *   Some Variation in specs vs. Power Supply Voltage / *   Monte Carlo (Vos, Ib), Process variation / *   Distortion (detailed non-linear behavior) / *   Behavior outside normal operating region / * / * Input Stage / V10  3 10 -500M / R10 10 11 6.90K / R11 10 12 6.90K / C11 11 12 0.2p / C12 1  0 6.00P / E12 71 14 POLY(4) 20 0 21 0 26 0 27 0   1.00M 20.1 20.1 1 1 / G12 1 0 62 0 1m / M12 11 14 15 15 NMI L=2.00U W=42.0U / M14 12  2 15 15 NMI L=2.00U W=42.0U / G14 2 0 62 0 1m / C14  2  0 6.00P / I15 15  4 50.0U / V16 16  4 -300M / GD16 16 1 TABLE {V(16,1)} ((-100,-1p)(0,0)(1m,1n)(2m,1m)(3m,1)) / V13  3 13 -300M / GD13 2 13 TABLE {V(2,13)} ((-100,-1p)(0,0)(1m,1n)(2m,1m)(3m,1)) / R70 1 0 20.6T / R71 2 0 20.6T / R72 1 2 20T / I80 1 2 0.5p / * / * Noise, PSRR, and CMRR / I20 21 20 423U / D20 20  0 DN1 / D21  0 21 DN1 / G26  0 26 POLY(1) 3 4   110U -49U / R26 26  0 1 / G27  0 27 POLY(2) 1 0 2 0   -440U 39.7U 39.7U / R27 27  0 1 / * / * Open Loop Gain, Slew Rate / G30  0 30 POLY(1) 12 11   0 1 / R30 30  0 1K / G31  0 31 POLY(1) 3 4 86 5.25 / R31 31  0 1 TC=2.8m / GD31 30 31 TABLE {V(30,31)} ((-11,-1)(-10,-10n)(0,0)(1m,1000)) / G32 32  0 POLY(1) 3 4 113.7 3.5 / R32 32  0 1 TC=2.65m / GD32 30 32 TABLE {V(30,32)} ((-1m,-1000)(0,0)(10,10n)(11,1)) / G33 0 33 30 0 1m / R33 33 0 1k / G34  0 34 33 0 425M / R34  34 0 1K / C34  34 0 74U / G37  0 37 34 0 1m / R37  37 0 1K / C37  37 0 41.6P / G38  0 38 37 0 1m / R38  39 0 1K / L38  38 39 100U / E38  35 0 38 0 1 / G35 33 0 TABLE {V(35,3)} ((-1,-1n)(0,0)(16,1n))(16.1,1)) / G36 33 0 TABLE {V(35,4)} ((-16.1,-1)((-16,-1n)(0,0)(1,1n)) / * / * Output Stage / R80 50 0 100MEG / G50 0 50 57 96 2 / R58 57  96 0.50 / R57 57  0 750 / C58  5  0 2.00P / G57  0 57 POLY(3) 3 0 4 0 35 0   0 0.67M 0.67M 1.5M / GD55 55 57 TABLE {V(55,57)} ((-2m,-1)(-1m,-1m)(0,0)(10,1n)) / GD56 57 56 TABLE {V(57,56)} ((-2m,-1)(-1m,-1m)(0,0)(10,1n)) / E55 55  0 POLY(2) 3 0 51 0 -0.7m 1 -40.0M / E56 56  0 POLY(2) 4 0 52 0 1.2m 1 -37.0M / R51 51 0 1k / R52 52 0 1k / GD51 50 51 TABLE {V(50,51)} ((-10,-1n)(0,0)(1m,1m)(2m,1)) / GD52 50 52 TABLE {V(50,52)} ((-2m,-1)(-1m,-1m)(0,0)(10,1n)) / G53  3  0 POLY(1) 51 0  -49U 1M / G54  0  4 POLY(1) 52 0  -49U -1M / * / * Current Limit / G99 96 5 99 0 1 / R98 0 98 1 TC=-2.8M,2.63U / G97 0 98 TABLE { V(96,5) } ((-11.0,-10.0M)(-1.00M,-9.9M)(0,0)(1.00M,9.9M)(11.0,10.0M)) / E97 99 0 VALUE { V(98)*((V(3)-V(4))*359M + 310M)} / D98 4 5 DESD / D99 5 3 DESD / * / * Temperature / Voltage Sensitive IQuiscent / R61 0 61 100 TC 3.11M 4.51U / G61 3 4 61 0 1 / G60 0 61 TABLE {V(3, 4)} / + ((0,0)(900M,0.0106U)(1.00,0.20U)(1.3,0.63U) / + (1.5,0.66U)(1.6,1.06U)(5.5,1.10U)) / * / * Temp Sensitive offset voltage / I73 0 70 DC 1uA / R74 0 70 1 TC=2 / E75 1 71 70 0 1 / * / * Temp Sensistive IBias / I62 0 62 DC 1uA / R62 0 62 REXP 58.2u / * Voltage on R62 used for G12, G14 in input stage / * / * Models / .MODEL NMI NMOS / .MODEL DESD  D   N=1 IS=1.00E-15 / .MODEL DL  D   N=1 IS=1F / .MODEL DN1 D   IS=1P KF=146E-18 AF=1 / .MODEL REXP RES TCE=10.1 / .ENDS MCP6001</Text> / </Model> / </CacheFrame> / </root>
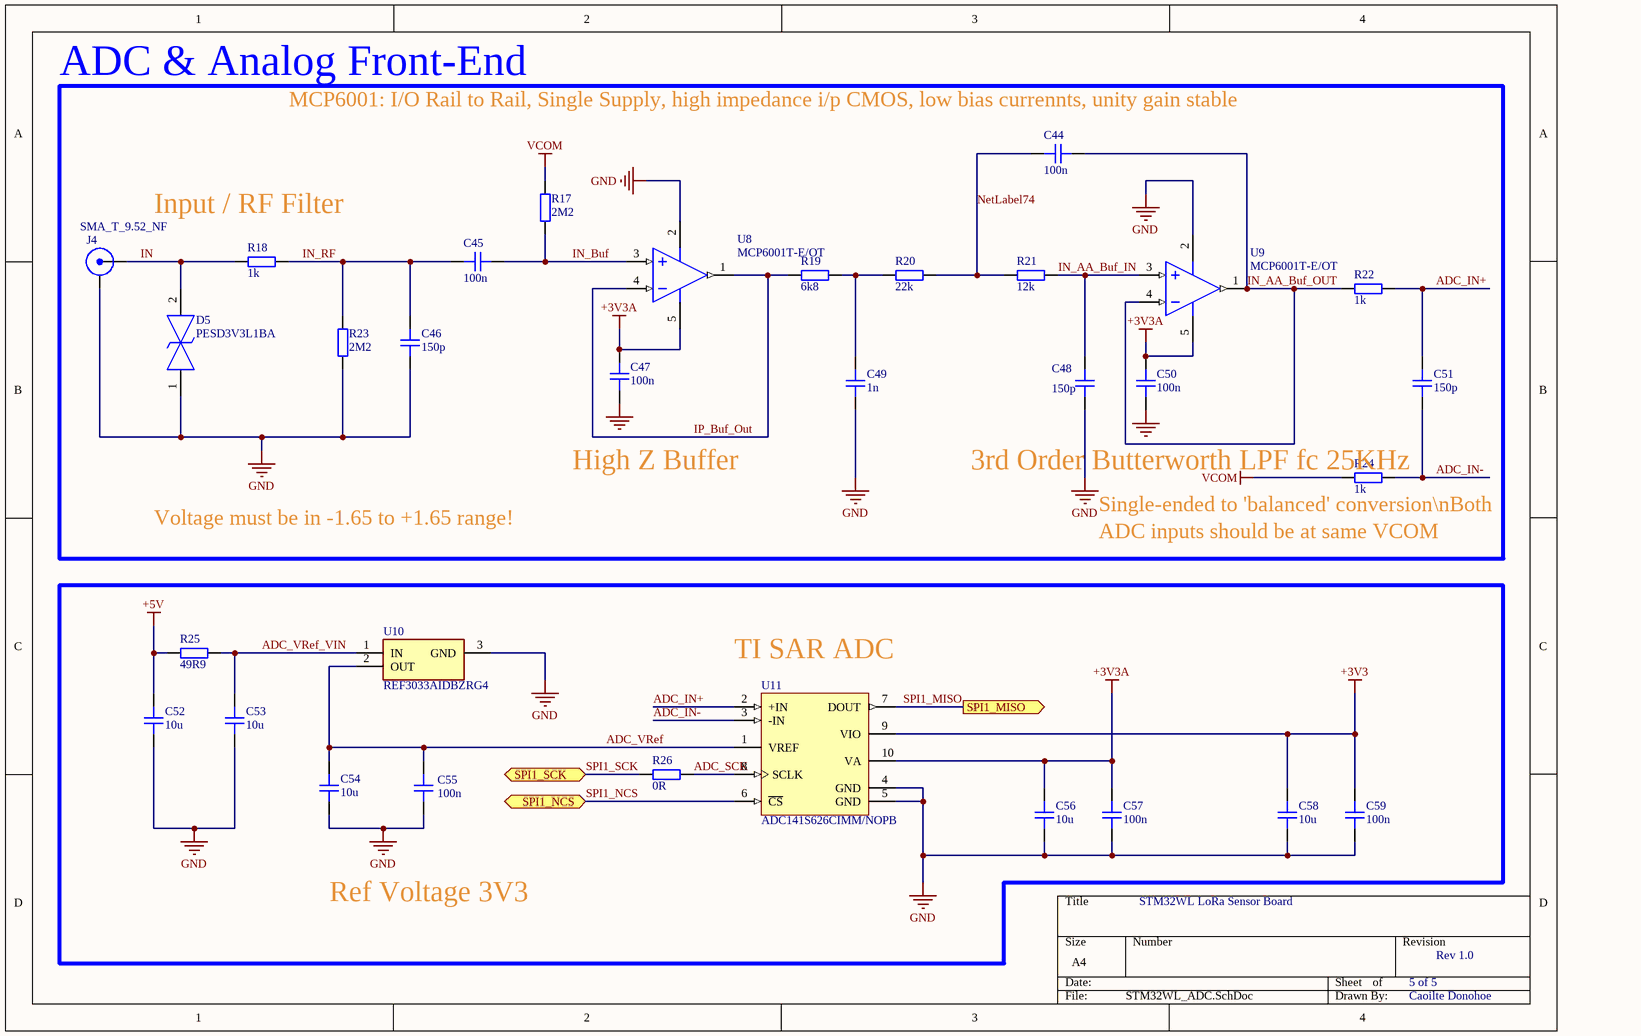
[diagram p4: STM32WL_ADC.SchDoc]

### Parts
C44  100n  [CAP_0402]
C45  100n  [CAP_0402]
C46  150p  [CAP_0402]
C47  100n  [CAP_0402]
C48  150p  [CAP_0402]
C49  1n  [CAP_0402]
C50  100n  [CAP_0402]
C51  150p  [CAP_0402]
C52  10u  [CAP_0603]
C53  10u  [CAP_0603]
C54  10u  [CAP_0603]
C55  100n  [CAP_0402]
C56  10u  [CAP_0603]
C57  100n  [CAP_0402]
C58  10u  [CAP_0603]
C59  100n  [CAP_0402]
D5  PESD3V3L1BA  [SOD2512X110N]
J4  SMA_T_9.52_NF  [CO_SAMTEC_SMA-J-P-ST-EMI]
R17  2M2  [RES_0402]
R18  1k  [RES_0402]
R19  6k8  [RES_0402]
R20  22k  [RES_0402]
R21  12k  [RES_0402]
R22  1k  [RES_0402]
R23  2M2  [RES_0402]
R24  1k  [RES_0402]
R25  49R9  [RES_0402]
R26  0R  [RES_0402]
U8  MCP6001T-E/OT  [SOT-23-OT5_L]
U9  MCP6001T-E/OT  [SOT-23-OT5_L]
U10  REF3033AIDBZRG4  [SOT95P237X112-3N]
U11  ADC141S626CIMM/NOPB  [MUB10A_M]

### Blocks framed on the sheet
ADC & Analog Front-End: C44-C51 D5 J4 R17-R24 U8 U9

### Ports
SPI1_MISO (out, see STM32WL_MCU_IOs[2B]), SPI1_NCS (bidir, see STM32WL_MCU_IOs[2B]), SPI1_SCK (bidir, see STM32WL_MCU_IOs[1B])

### Nets
+3V3: C58.2 C59.2 U11.9(VIO)
+3V3A: C47.1 C50.1 C56.2 C57.2 U8.5(VDD) U9.5(VDD) U11.10(VA)
+5V: C52.2 R25.1
GND: C46.1 C47.2 C48.1 C49.1 C50.2 C52.1 C53.1 C54.1 C55.1 C56.1 C57.1 C58.1 C59.1 D5.1 J4.2(Y) R23.1 U8.2(VSS) U9.2(VSS) U10.3(GND) U11.4(GND) U11.5(GND)
VCOM: R17.2 R24.2
ADC_IN+: C51.1 R22.1 U11.2(+IN)
ADC_IN-: C51.2 R24.1 U11.3(-IN)
ADC_SCK: R26.2 U11.8(SCLK)
ADC_VRef: C54.2 C55.2 U10.2(OUT) U11.1(VREF)
ADC_VRef_VIN: C53.2 R25.2 U10.1(IN)
IN: D5.2 J4.1(X) R18.1
IN_AA_Buf_IN: C48.2 R21.1 U9.3(VIN+)
IN_AA_Buf_OUT: C44.1 R22.2 U9.1(VOUT) U9.4(VIN-)
IN_Buf: C45.1 R17.1 U8.3(VIN+)
IN_RF: C45.2 C46.2 R18.2 R23.2
IP_Buf_Out: R19.2 U8.1(VOUT) U8.4(VIN-)
NetLabel74: C44.2 R20.1 R21.2
SPI1_MISO: U11.7(DOUT) ; port SPI1_MISO
SPI1_NCS: U11.6(~{CS}) ; port SPI1_NCS
SPI1_SCK: R26.1 ; port SPI1_SCK
NetC49_2: C49.2 R19.1 R20.2

### Notes on the sheet
- (near C44) MCP6001: I/O Rail to Rail, Single Supply, high impedance i/p CMOS, low bias currennts, unity gain stable
- (near R18) Input / RF Filter
- High Z Buffer
- (near R24) 3rd Order Butterworth LPF fc 25KHz
- (near R24) Single-ended to 'balanced' conversion\nBoth
- Voltage must be in -1.65 to +1.65 range!
- (near R24) ADC inputs should be at same VCOM
- (near U11) TI SAR ADC
- Ref Voltage 3V3
- STM32WL LoRa Sensor Board
- 5 of 5
- Rev 1.0
- Caoilte Donohoe

### Library data of the parts
C44-C51 C55 C57 C59 = CAP_0402_16V: Capacitor SMD 0402 16V
C52-C54 C56 C58 = CAP_0603_16V: Capacitor SMD 0603 16V
D5 = PESD3V3L1BA: TVS Diode (Bi-directional); Manufacturer_Name: Nexperia; Datasheet Link: https://datasheet.datasheetarchive.com/originals/distributors/Datasheets-26/DSA-502681.pdf; Height: 1.1mm; Manufacturer_Part_Number: PESD3V3L1BA; Mouser Part Number: N/A; Mouser Price/Stock: https://www.mouser.co.uk/ProductDetail/Nexperia/PESD3V3L1BA?qs=vHuUswq2%252BswBNSPO0jzUyg%3D%3D
J4 = SMA_T_9.52_NF: as J2 on sheet STM32WL_RF
R17-R26 = RES_0402: Resistor SMD 0402
U8 U9 = CMP-0187-00458-3: None; Output Current: 23mA; Number of Circuits: 1; Input Offset Voltage-Max: 4.5mV; Nominal Supply Current: 100uA; Min Supply Voltage: 1.8V; Voltage: 6V; Operating Supply Voltage: 5.5V; Gain Bandwidth Product: 1MHz; Amplifier Type: GENERAL PURPOSE; Voltage Gain: 112dB; Slew Rate: 0.6V/µs; Power Supply Rejection Ratio (PSRR): 86dB; Input Bias Current: 1pA; Common Mode Rejection Ratio: 60dB; Package Quantity: 3000; Lead Free: Lead Free; Case/Package: SOT-23; Max Operating Temperature: 125°C; RoHS Compliant: Yes; Radiation Hardening: No; Number of Channels: 1; Length: 3.1mm; Height: 1.3mm; Output Current per Channel: 23mA; Supply Current: 100uA; Packaging: Tape and Reel; Technology: CMOS; Number of Elements: 1; Number of Pins: 5; Input Offset Voltage (Vos): 4.5mV; Width: 1.8mm; Contact Plating: Tin; Mount: Surface Mount; Slew Rate-Nom: 0.6V/µs; Unity Gain Bandwidth Product: 1MHz; REACH SVHC: No SVHC; Number of Amplifiers: 1; Max Supply Voltage: 6V; Operating Supply Current: 100uA; Min Operating Temperature: -40°C; Bandwidth: 1MHz
U10 = REF3033AIDBZRG4: Integrated Circuit; Manufacturer_Name: Texas Instruments; Datasheet Link: https://www.ti.com/lit/ds/symlink/ref3030.pdf?ts=1639296719724; Height: 1.12mm; Manufacturer_Part_Number: REF3033AIDBZRG4; Mouser Part Number: 595-REF3033AIDBZRG4; Mouser Price/Stock: https://www.mouser.co.uk/ProductDetail/Texas-Instruments/REF3033AIDBZRG4?qs=sSOk4GDDv7x3KhdEagQjiQ%3D%3D; Arrow Part Number: REF3033AIDBZRG4; Arrow Price/Stock: https://www.arrow.com/en/products/ref3033aidbzrg4/texas-instruments
U11 = CMP-0054-00477-2: 14-Bit, 50 kSPS to 250 kSPS, Differential Input, Micro Power A/D Converter, 10-pin Mini SOIC, Pb-Free; Manufacturer: National Semiconductor; CompType: ADC IC; PowerWise: Y; PackageTopMarking: ZXTT*X94C; DatasheetVersion: Jan-2009; PackageVersion: revB, Jul-2003; RoHS: Y; ComponentLink3Description: MUB10A Package Page; ComponentLink2URL: http://www.national.com/pf/AD/ADC141S626.html; Code_JEDEC: MO-187-BA; PackageReference: MUB10A; ComponentLink3URL: http://www.national.com/packaging/folders/mub10a.html; ComponentLink1URL: http://www.national.com/ds/AD/ADC141S626.pdf; PinCount: 10; RevisionNote: Component URLs added; PackageDescription: Mini-SO, Molded, .118 x .118 x .034in Body, 10 Lead, .0197in Pitch; ComponentLink1Description: ADC141S626 Datasheet; ComponentLink2Description: ADC141S626 Web Page

## Nets that join several sheets
+3V3: STM32WL_MCU_IOs (9 pins), stm32wl_Power (C35.2 D4.A L10.2 R11.2), STM32WL_Sensors (7 pins), STM32WL_ADC (C58.2 C59.2 U11.9)
+3V3A: STM32WL_MCU_IOs (C2.2 U1.41), STM32WL_RF (R7.2), stm32wl_Power (5 pins), STM32WL_ADC (7 pins)
+5V: stm32wl_Power (6 pins), STM32WL_ADC (C52.2 R25.1)
GND: STM32WL_MCU_IOs (10 pins), STM32WL_RF (23 pins), stm32wl_Power (19 pins), STM32WL_Sensors (13 pins), STM32WL_ADC (21 pins)
VCOM: stm32wl_Power (U5.1 U5.3), STM32WL_ADC (R17.2 R24.2)
FE_CTRL2: STM32WL_MCU_IOs (U1.34), STM32WL_RF (R6.1)
NetU1_12: STM32WL_MCU_IOs (U1.12), STM32WL_Sensors (U6.12)
SEN_SCL: STM32WL_MCU_IOs (R1.1 U1.4), STM32WL_Sensors (U6.23 U7.4)
SEN_SDA: STM32WL_MCU_IOs (R2.1 U1.5), STM32WL_Sensors (U6.24 U7.3)
SPI1_MISO: STM32WL_MCU_IOs (U1.2), STM32WL_ADC (U11.7)
SPI1_NCS: STM32WL_MCU_IOs (U1.3), STM32WL_ADC (U11.6)
SPI1_SCK: STM32WL_MCU_IOs (U1.8), STM32WL_ADC (R26.1)